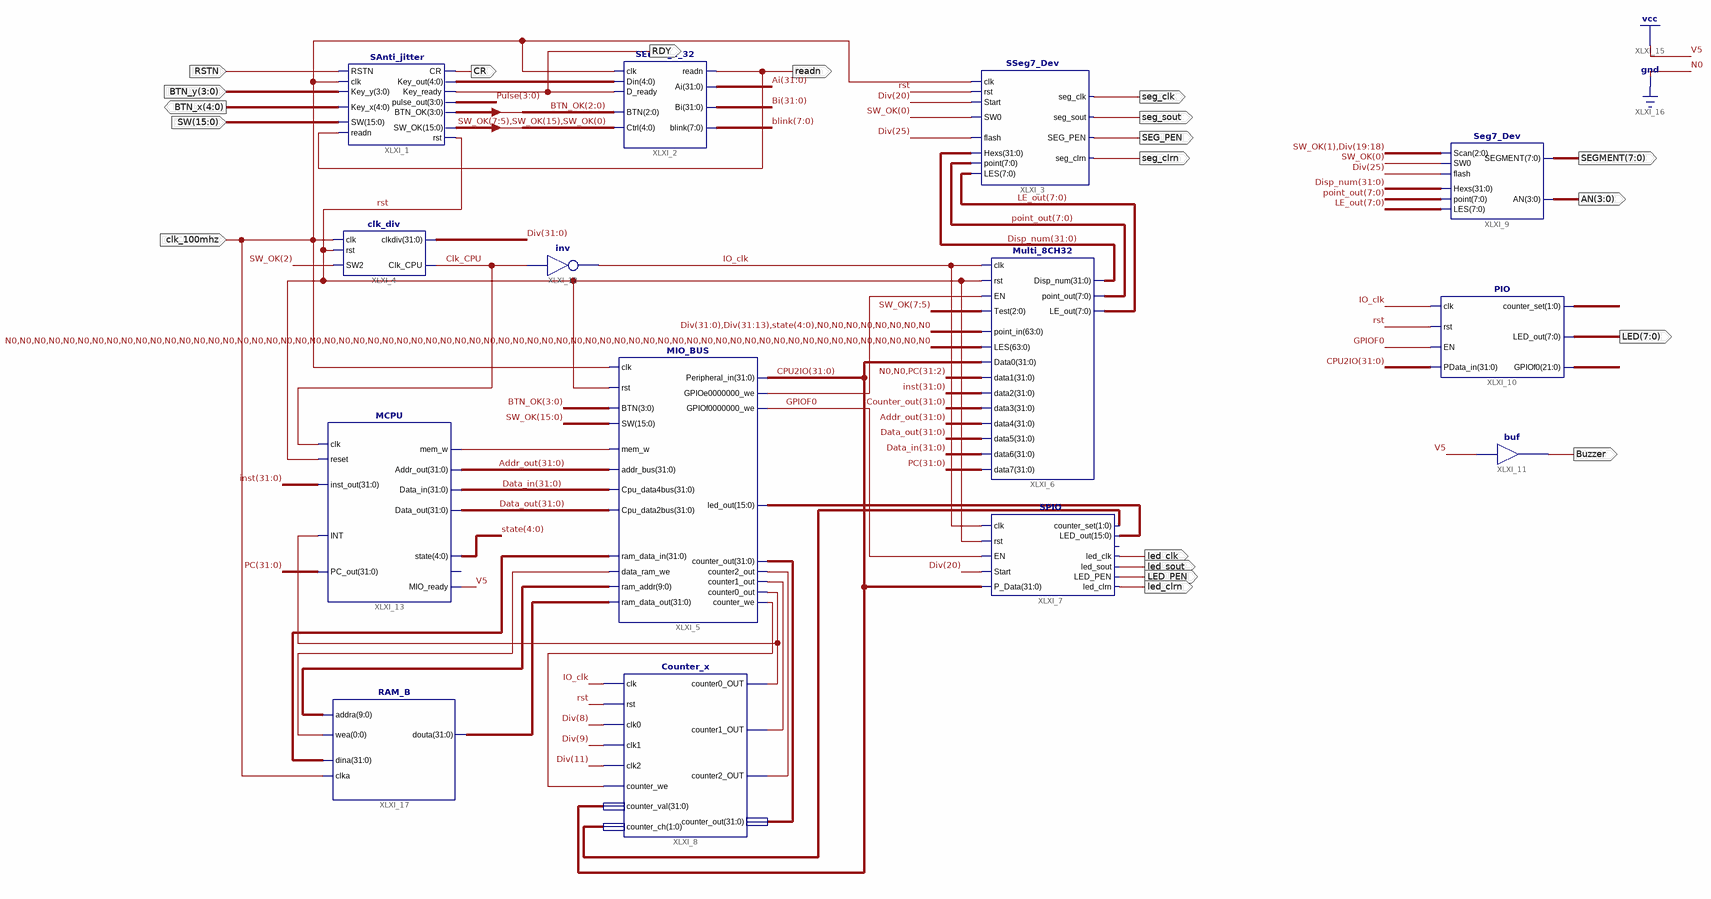
[diagram p0: schematic sheet 1]
// Xilinx ISE schematic Top_OExp09_IP2MCPU.sch (kintex7) as structural Verilog: 14 symbols, 20 ports
module Top_OExp09_IP2MCPU (
  input  RSTN,
  input  clk_100mhz,
  input  [3:0] BTN_y,
  input  [15:0] SW,
  output CR,
  output RDY,
  output readn,
  output [4:0] BTN_x,
  output seg_clk,
  output seg_sout,
  output SEG_PEN,
  output seg_clrn,
  output led_clk,
  output led_sout,
  output LED_PEN,
  output led_clrn,
  output [7:0] SEGMENT,
  output [3:0] AN,
  output [7:0] LED,
  output Buzzer
);

  wire Clk_CPU, GPIOF0, IO_clk, rst, XLXN_41, XLXN_68, XLXN_82, XLXN_83, XLXN_85, XLXN_86;
  wire [0:0] XLXN_60;
  wire [1:0] XLXN_104, XLXN_123;
  wire [3:0] BTN_OK, Pulse;
  wire [4:0] state, XLXN_1;
  wire [7:0] blink, LE_out, point_out;
  wire [9:0] XLXN_61;
  wire [15:0] SW_OK, XLXN_105;
  wire [21:0] XLXN_125;
  wire [31:0] Addr_out, Ai, Bi, Counter_out, CPU2IO, Data_in, Data_out, Disp_num, Div, inst, PC, XLXN_59,
       XLXN_62, XLXN_84;

  SAnti_jitter XLXI_1 (
    .SW(SW), .readn(readn), .Key_y(BTN_y), .Key_x(BTN_x), .RSTN(RSTN), .clk(clk_100mhz), .Key_out(XLXN_1),
    .Key_ready(RDY), .CR(CR), .rst(rst), .SW_OK(SW_OK), .pulse_out(Pulse), .BTN_OK(BTN_OK));
  Seg7_Dev XLXI_9 (
    .LES(LE_out), .Scan({SW_OK[1], Div[19:18]}), .SEGMENT(SEGMENT), .AN(AN), .point(point_out),
    .flash(Div[25]), .SW0(SW_OK[0]), .Hexs(Disp_num));
  PIO XLXI_10 (
    .clk(IO_clk), .rst(rst), .EN(GPIOF0), .PData_in(CPU2IO), .GPIOf0(XLXN_125), .LED_out(LED),
    .counter_set(XLXN_123));
  SEnter_2_32 XLXI_2 (
    .readn(readn), .Ai(Ai), .Bi(Bi), .blink(blink), .Din(XLXN_1), .D_ready(RDY), .clk(clk_100mhz),
    .Ctrl({SW_OK[7:5], SW_OK[15], SW_OK[0]}), .BTN(BTN_OK[2:0]));
  clk_div XLXI_4 (.rst(rst), .clk(clk_100mhz), .SW2(SW_OK[2]), .clkdiv(Div), .Clk_CPU(Clk_CPU));
  SSeg7_Dev XLXI_3 (
    .LES(LE_out), .SEG_PEN(SEG_PEN), .seg_sout(seg_sout), .seg_clrn(seg_clrn), .point(point_out),
    .Hexs(Disp_num), .SW0(SW_OK[0]), .flash(Div[25]), .seg_clk(seg_clk), .clk(clk_100mhz), .rst(rst),
    .Start(Div[20]));
  Multi_8CH32 XLXI_6 (
    .Test(SW_OK[7:5]), .point_in({Div, Div[31:13], state, {8{1'b0}}}), .EN(XLXN_86), .clk(IO_clk), .rst(rst),
    .LES({64{1'b0}}), .Data0(CPU2IO), .data1({2'b00, PC[31:2]}), .data2(inst), .data3(Counter_out),
    .data4(Addr_out), .data5(Data_out), .data6(Data_in), .data7(PC), .point_out(point_out), .LE_out(LE_out),
    .Disp_num(Disp_num));
  MIO_BUS XLXI_5 (
    .rst(rst), .clk(clk_100mhz), .mem_w(XLXN_41), .addr_bus(Addr_out), .Cpu_data4bus(Data_in),
    .Cpu_data2bus(Data_out), .ram_data_out(XLXN_62), .ram_addr(XLXN_61), .data_ram_we(XLXN_60[0]),
    .ram_data_in(XLXN_59), .counter_out(XLXN_84), .counter2_out(XLXN_83), .counter1_out(XLXN_82),
    .counter0_out(XLXN_85), .counter_we(XLXN_68), .BTN(BTN_OK), .SW(SW_OK), .led_out(XLXN_105),
    .Peripheral_in(CPU2IO), .GPIOe0000000_we(XLXN_86), .GPIOf0000000_we(GPIOF0));
  not XLXI_12 (IO_clk, Clk_CPU);
  MCPU XLXI_13 (
    .clk(Clk_CPU), .reset(rst), .inst_out(inst), .INT(XLXN_85), .Addr_out(Addr_out), .mem_w(XLXN_41),
    .Data_out(Data_out), .Data_in(Data_in), .PC_out(PC), .MIO_ready(1'b1), .state(state));  // open: CPU_MIO
  RAM_B XLXI_17 (.addra(XLXN_61), .clka(clk_100mhz), .wea(XLXN_60[0]), .dina(XLXN_59), .douta(XLXN_62));
  Counter_x XLXI_8 (
    .clk(IO_clk), .rst(rst), .clk0(Div[8]), .clk1(Div[9]), .clk2(Div[11]), .counter_we(XLXN_68),
    .counter_val(CPU2IO), .counter_ch(XLXN_104), .counter0_OUT(XLXN_85), .counter1_OUT(XLXN_82),
    .counter2_OUT(XLXN_83), .counter_out(XLXN_84));
  SPIO XLXI_7 (
    .clk(IO_clk), .P_Data(CPU2IO), .rst(rst), .EN(GPIOF0), .Start(Div[20]), .led_clk(led_clk),
    .LED_out(XLXN_105), .counter_set(XLXN_104), .led_clrn(led_clrn), .LED_PEN(LED_PEN), .led_sout(led_sout));  // open: GPIOf0
  buf XLXI_11 (Buzzer, 1'b1);
endmodule
